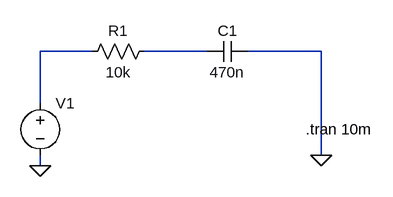
[diagram p0: schematic guitar_input_signal.asc]
guitar_input_signal.asc, the LTspice schematic file:
Version 4
SHEET 1 880 680
WIRE 240 192 160 192
WIRE 416 192 320 192
WIRE 592 192 480 192
WIRE 160 272 160 192
WIRE 592 352 592 192
WIRE 160 368 160 352
FLAG 160 368 0
FLAG 592 352 0
SYMBOL voltage 160 256 R0
WINDOW 3 24 96 Invisible 2
SYMATTR Value SINE(0 1 400 0 0 0)
SYMATTR InstName V1
SYMBOL res 336 176 R90
WINDOW 0 0 56 VBottom 2
WINDOW 3 32 56 VTop 2
SYMATTR InstName R1
SYMATTR Value 10k
SYMBOL cap 480 176 R90
WINDOW 0 0 32 VBottom 2
WINDOW 3 32 32 VTop 2
SYMATTR InstName C1
SYMATTR Value 470n
TEXT 568 312 Left 2 !.tran 10m

The netlist it stands for:
* guitar_input_signal.asc
V1 N001 0 SINE(0 1 400 0 0 0)
R1 N002 N001 10k
C1 0 N002 470n
.tran 10m
.backanno
.end